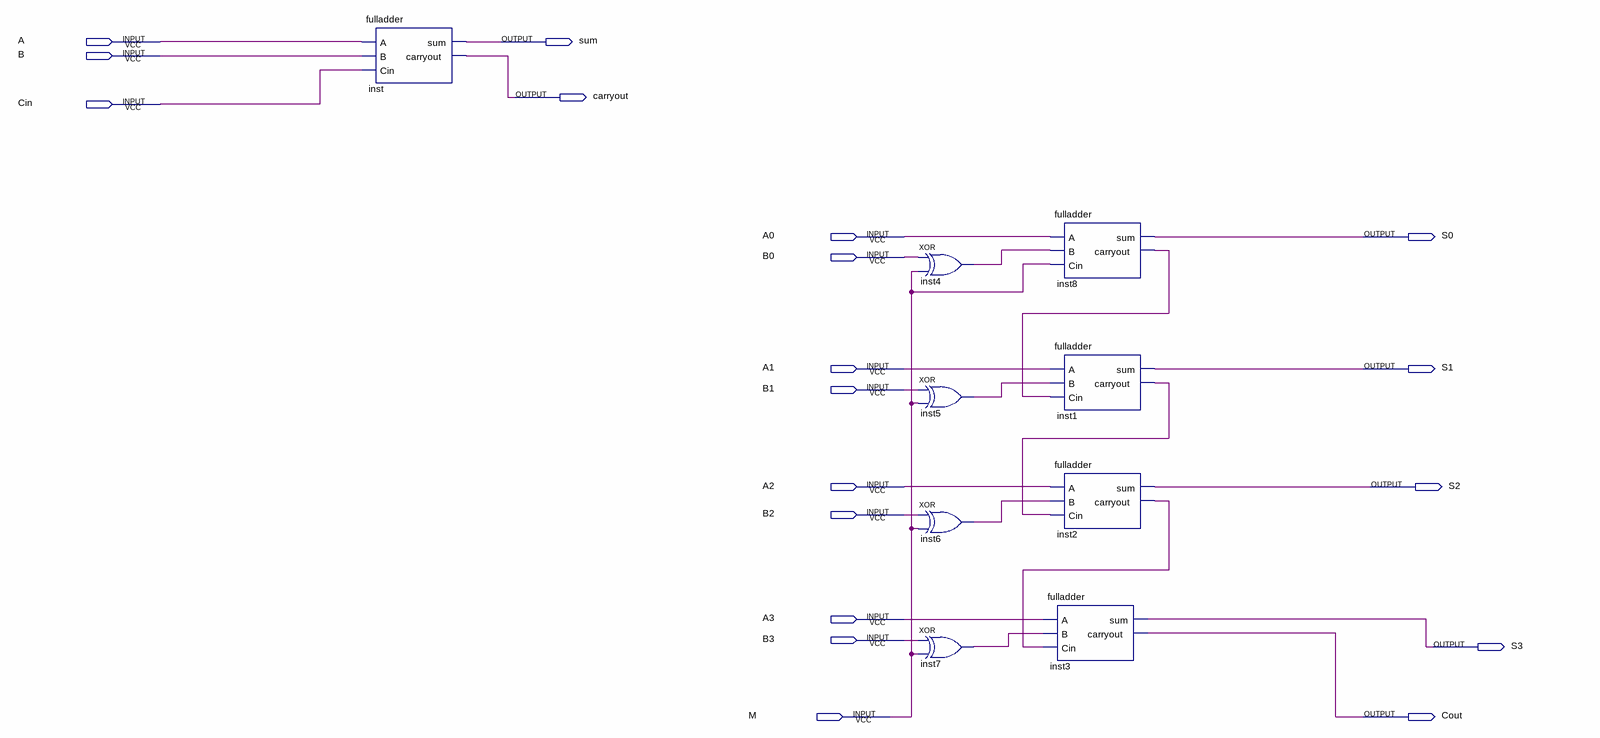
[diagram p0: schematic sheet]
// Quartus schematic lab1-1.bdf as structural Verilog: 9 symbols, 19 pins
module \lab1-1  (
  input  A,
  input  B,
  input  Cin,
  input  A0,
  input  B0,
  input  A1,
  input  B1,
  input  A2,
  input  B2,
  input  A3,
  input  B3,
  input  M,
  output sum,
  output carryout,
  output S0,
  output S1,
  output S2,
  output S3,
  output Cout
);

  wire inst1_carryout, inst2_carryout, inst4_out, inst5_out, inst6_out, inst7_out, inst8_carryout;

  fulladder inst (.A(A), .B(B), .Cin(Cin), .sum(sum), .carryout(carryout));
  xor inst4 (inst4_out, B0, M);
  xor inst5 (inst5_out, B1, M);
  xor inst6 (inst6_out, B2, M);
  xor inst7 (inst7_out, B3, M);
  fulladder inst8 (.A(A0), .B(inst4_out), .Cin(M), .sum(S0), .carryout(inst8_carryout));
  fulladder inst1 (.A(A1), .B(inst5_out), .Cin(inst8_carryout), .sum(S1), .carryout(inst1_carryout));
  fulladder inst2 (.A(A2), .B(inst6_out), .Cin(inst1_carryout), .sum(S2), .carryout(inst2_carryout));
  fulladder inst3 (.A(A3), .B(inst7_out), .Cin(inst2_carryout), .sum(S3), .carryout(Cout));
endmodule
